# EAGLE design Micro_SD_Block (EAGLE 6.5.0)

## Sheet 1 of 2
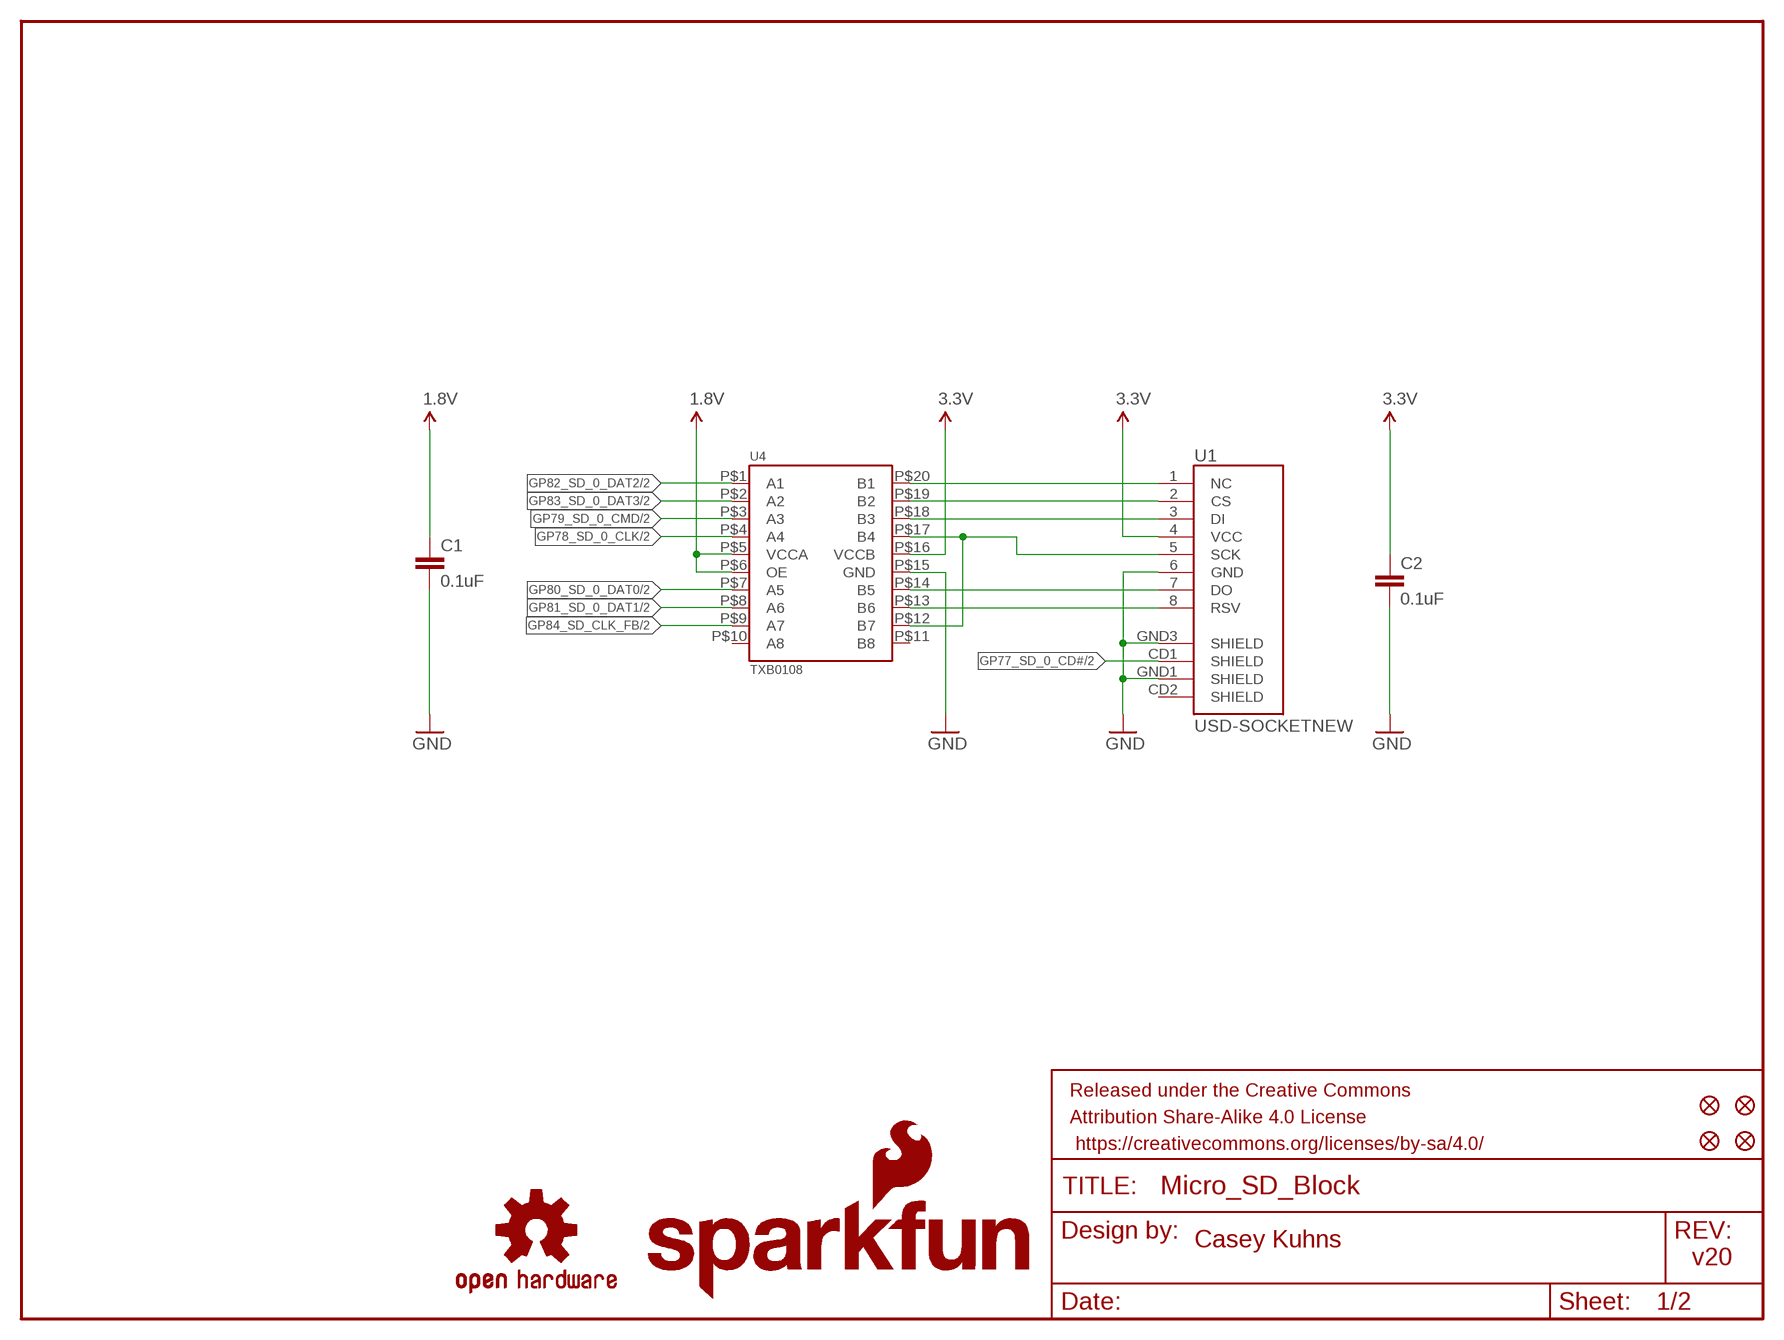
[diagram p0: schematic, sheet 1]

### Parts
C1  0.1uF  0.1UF-25V(+80/-20%)(0603)  [0603-CAP]
C2  0.1uF  0.1UF-25V(+80/-20%)(0603)  [0603-CAP]
FID1  FIDUCIAL1X2  [FIDUCIAL-1X2]
FID2  FIDUCIAL1X2  [FIDUCIAL-1X2]
FID3  FIDUCIAL1X2  [FIDUCIAL-1X2]
FID4  FIDUCIAL1X2  [FIDUCIAL-1X2]
FRAME1  FRAME-LETTER  [CREATIVE_COMMONS]
LOGO1  OSHW-LOGOS  [OSHW-LOGO-S]
LOGO4  SFE_LOGO_NAME_FLAME.1_INCH  [SFE_LOGO_NAME_FLAME_.1]
U1  USD-SOCKETNEW  [MICRO-SD-SOCKET-PP]
U4  TXB0108  [UFDFN-20]

### Nets
1.8V: C1.1 U4.P$5(VCCA) U4.P$6(OE) ; also sheet 2
3.3V: C2.1 U1.4(VCC) U4.P$16(VCCB) ; also sheet 2
GND: C1.2 C2.2 U1.6(GND) U1.GND1(SHIELD) U1.GND3(SHIELD) U4.P$15(GND) ; also sheet 2
GP77_SD_0_CD#: U1.CD1(SHIELD) ; also sheet 2
GP78_SD_0_CLK: U4.P$4(A4) ; also sheet 2
GP79_SD_0_CMD: U4.P$3(A3) ; also sheet 2
GP80_SD_0_DAT0: U4.P$7(A5) ; also sheet 2
GP81_SD_0_DAT1: U4.P$8(A6) ; also sheet 2
GP82_SD_0_DAT2: U4.P$1(A1) ; also sheet 2
GP83_SD_0_DAT3: U4.P$2(A2) ; also sheet 2
GP84_SD_CLK_FB: U4.P$9(A7) ; also sheet 2
N$1: U1.1(NC) U4.P$20(B1)
N$2: U1.2(CS) U4.P$19(B2)
N$3: U1.3(DI) U4.P$18(B3)
N$5: U1.7(DO) U4.P$14(B5)
N$6: U1.8(RSV) U4.P$13(B6)
SCK: U1.5(SCK) U4.P$12(B7) U4.P$17(B4)
Unconnected: U1.CD2(SHIELD) U4.P$10(A8) U4.P$11(B8)

### Notes on the sheet
- Casey Kuhns
- v20

## Sheet 2 of 2
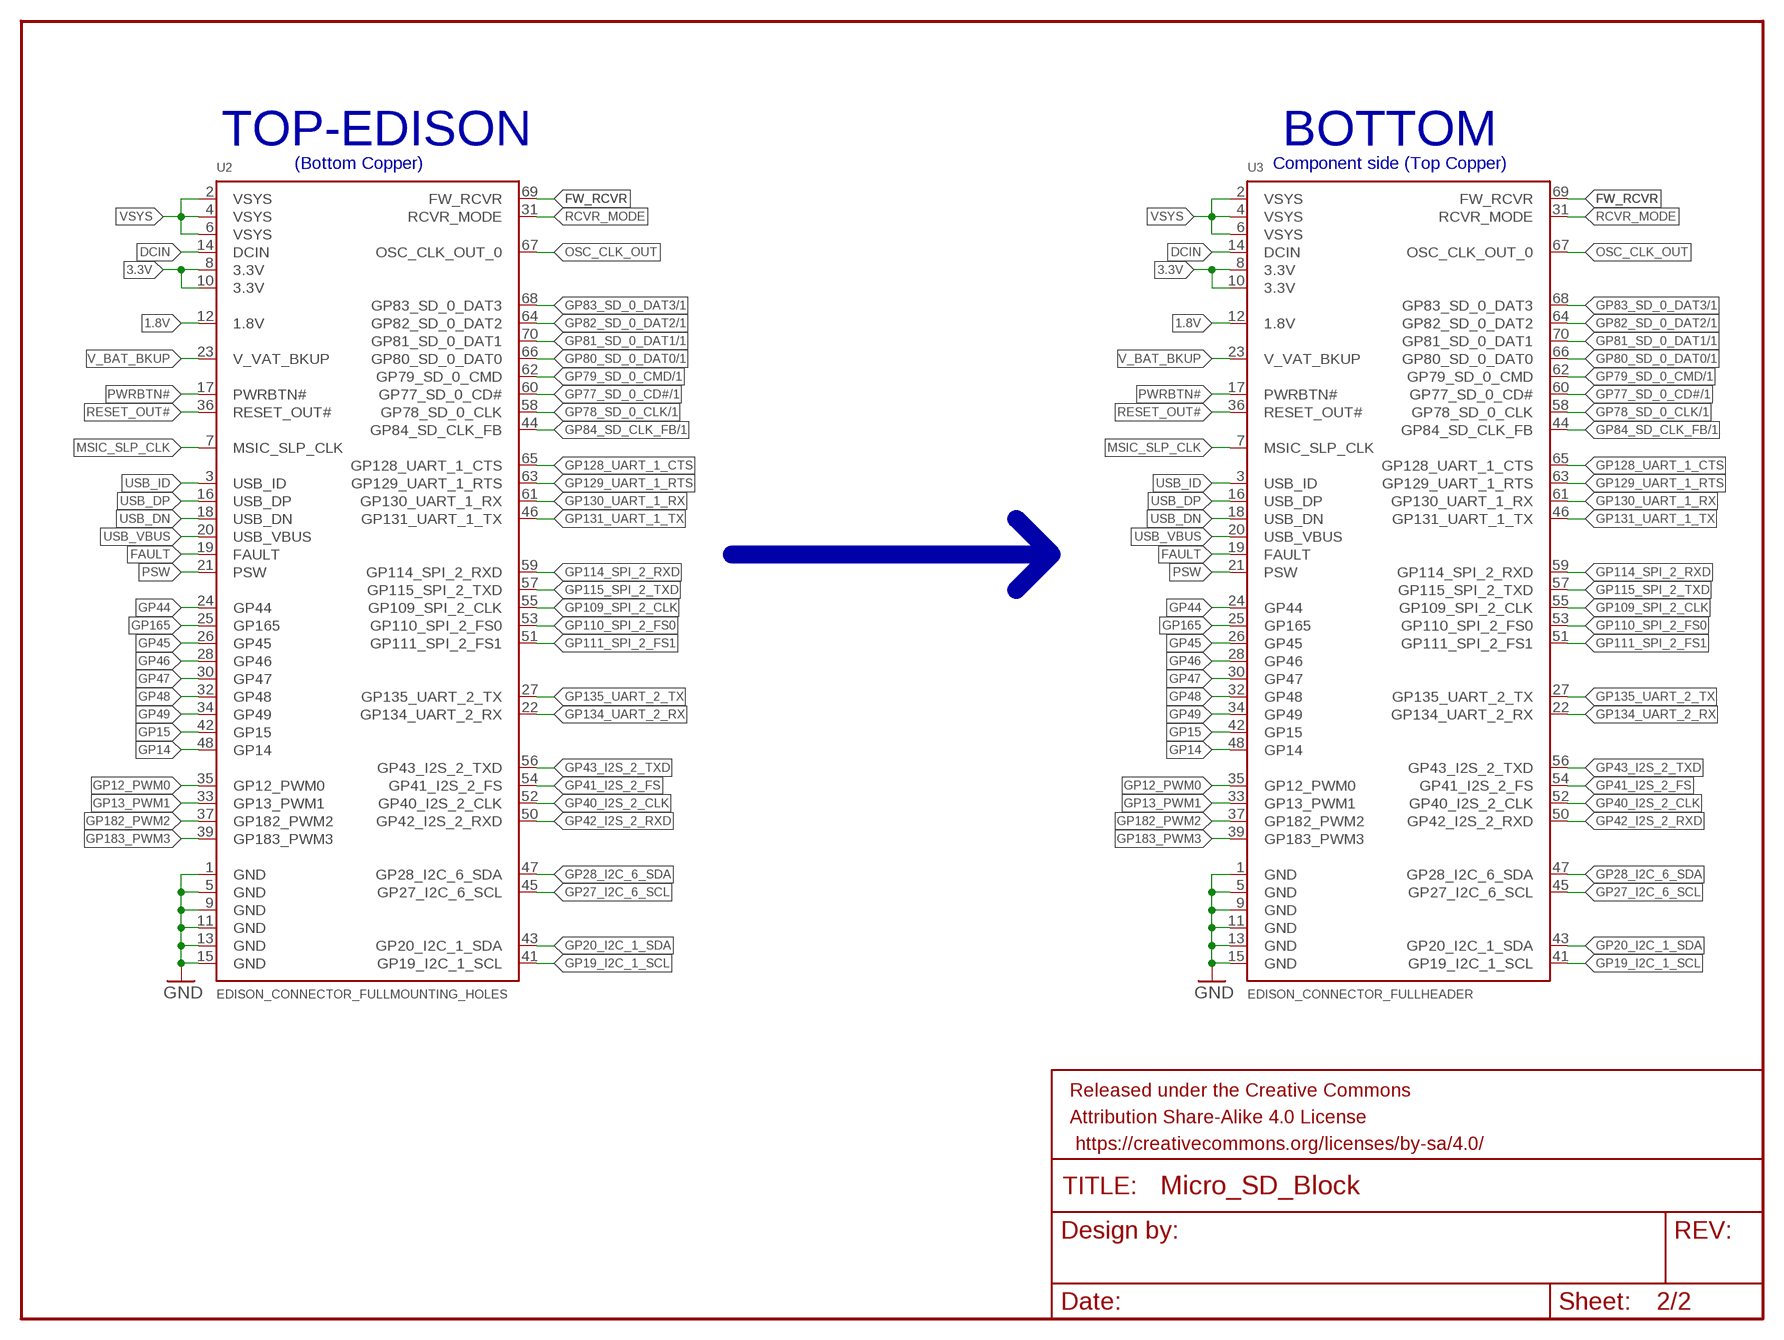
[diagram p1: schematic, sheet 2]

### Parts
FRAME2  FRAME-LETTER  [CREATIVE_COMMONS]
U2  EDISON_CONNECTOR_FULLMOUNTING_HOLES  [EDISON_DAUGHTER]
U3  EDISON_CONNECTOR_FULLHEADER  [DF40C-70DP-0.4(51)]

### Nets
1.8V: U2.12(1.8V) U3.12(1.8V) ; also sheet 1
3.3V: U2.8(3.3V) U2.10(3.3V) U3.8(3.3V) U3.10(3.3V) ; also sheet 1
DCIN: U2.14(DCIN) U3.14(DCIN)
FAULT: U2.19(FAULT) U3.19(FAULT)
FW_RCVR: U2.69(FW_RCVR) U3.69(FW_RCVR)
GND: U2.1(GND) U2.5(GND) U2.9(GND) U2.11(GND) U2.13(GND) U2.15(GND) U3.1(GND) U3.5(GND) U3.9(GND) U3.11(GND) U3.13(GND) U3.15(GND) ; also sheet 1
GP12_PWM0: U2.35(GP12_PWM0) U3.35(GP12_PWM0)
GP13_PWM1: U2.33(GP13_PWM1) U3.33(GP13_PWM1)
GP14: U2.48(GP14) U3.48(GP14)
GP15: U2.42(GP15) U3.42(GP15)
GP19_I2C_1_SCL: U2.41(GP19_I2C_1_SCL) U3.41(GP19_I2C_1_SCL)
GP20_I2C_1_SDA: U2.43(GP20_I2C_1_SDA) U3.43(GP20_I2C_1_SDA)
GP27_I2C_6_SCL: U2.45(GP27_I2C_6_SCL) U3.45(GP27_I2C_6_SCL)
GP28_I2C_6_SDA: U2.47(GP28_I2C_6_SDA) U3.47(GP28_I2C_6_SDA)
GP40_I2S_2_CLK: U2.52(GP40_I2S_2_CLK) U3.52(GP40_I2S_2_CLK)
GP41_I2S_2_FS: U2.54(GP41_I2S_2_FS) U3.54(GP41_I2S_2_FS)
GP42_I2S_2_RXD: U2.50(GP42_I2S_2_RXD) U3.50(GP42_I2S_2_RXD)
GP43_I2S_2_TXD: U2.56(GP43_I2S_2_TXD) U3.56(GP43_I2S_2_TXD)
GP44: U2.24(GP44) U3.24(GP44)
GP45: U2.26(GP45) U3.26(GP45)
GP46: U2.28(GP46) U3.28(GP46)
GP47: U2.30(GP47) U3.30(GP47)
GP48: U2.32(GP48) U3.32(GP48)
GP49: U2.34(GP49) U3.34(GP49)
GP77_SD_0_CD#: U2.60(GP77_SD_0_CD#) U3.60(GP77_SD_0_CD#) ; also sheet 1
GP78_SD_0_CLK: U2.58(GP78_SD_0_CLK) U3.58(GP78_SD_0_CLK) ; also sheet 1
GP79_SD_0_CMD: U2.62(GP79_SD_0_CMD) U3.62(GP79_SD_0_CMD) ; also sheet 1
GP80_SD_0_DAT0: U2.66(GP80_SD_0_DAT0) U3.66(GP80_SD_0_DAT0) ; also sheet 1
GP81_SD_0_DAT1: U2.70(GP81_SD_0_DAT1) U3.70(GP81_SD_0_DAT1) ; also sheet 1
GP82_SD_0_DAT2: U2.64(GP82_SD_0_DAT2) U3.64(GP82_SD_0_DAT2) ; also sheet 1
GP83_SD_0_DAT3: U2.68(GP83_SD_0_DAT3) U3.68(GP83_SD_0_DAT3) ; also sheet 1
GP84_SD_CLK_FB: U2.44(GP84_SD_CLK_FB) U3.44(GP84_SD_CLK_FB) ; also sheet 1
GP109_SPI_2_CLK: U2.55(GP109_SPI_2_CLK) U3.55(GP109_SPI_2_CLK)
GP110_SPI_2_FS0: U2.53(GP110_SPI_2_FS0) U3.53(GP110_SPI_2_FS0)
GP111_SPI_2_FS1: U2.51(GP111_SPI_2_FS1) U3.51(GP111_SPI_2_FS1)
GP114_SPI_2_RXD: U2.59(GP114_SPI_2_RXD) U3.59(GP114_SPI_2_RXD)
GP115_SPI_2_TXD: U2.57(GP115_SPI_2_TXD) U3.57(GP115_SPI_2_TXD)
GP128_UART_1_CTS: U2.65(GP128_UART_1_CTS) U3.65(GP128_UART_1_CTS)
GP129_UART_1_RTS: U2.63(GP129_UART_1_RTS) U3.63(GP129_UART_1_RTS)
GP130_UART_1_RX: U2.61(GP130_UART_1_RX) U3.61(GP130_UART_1_RX)
GP131_UART_1_TX: U2.46(GP131_UART_1_TX) U3.46(GP131_UART_1_TX)
GP134_UART_2_RX: U2.22(GP134_UART_2_RX) U3.22(GP134_UART_2_RX)
GP135_UART_2_TX: U2.27(GP135_UART_2_TX) U3.27(GP135_UART_2_TX)
GP165: U2.25(GP165) U3.25(GP165)
GP182_PWM2: U2.37(GP182_PWM2) U3.37(GP182_PWM2)
GP183_PWM3: U2.39(GP183_PWM3) U3.39(GP183_PWM3)
MSIC_SLP_CLK: U2.7(MSIC_SLP_CLK) U3.7(MSIC_SLP_CLK)
OSC_CLK_OUT: U2.67(OSC_CLK_OUT_0) U3.67(OSC_CLK_OUT_0)
PSW: U2.21(PSW) U3.21(PSW)
PWRBTN#: U2.17(PWRBTN#) U3.17(PWRBTN#)
RCVR_MODE: U2.31(RCVR_MODE) U3.31(RCVR_MODE)
RESET_OUT#: U2.36(RESET_OUT#) U3.36(RESET_OUT#)
USB_DN: U2.18(USB_DN) U3.18(USB_DN)
USB_DP: U2.16(USB_DP) U3.16(USB_DP)
USB_ID: U2.3(USB_ID) U3.3(USB_ID)
USB_VBUS: U2.20(USB_VBUS) U3.20(USB_VBUS)
V_BAT_BKUP: U2.23(V_VAT_BKUP) U3.23(V_VAT_BKUP)
VSYS: U2.2(VSYS) U2.4(VSYS) U2.6(VSYS) U3.2(VSYS) U3.4(VSYS) U3.6(VSYS)

### Buses
B$1

### Notes on the sheet
- TOP-EDISON | BOTTOM
- (Bottom Copper) | Component side (Top Copper)

## Library data of the parts
C1 C2 = SparkFun-Capacitors:0.1UF-25V(+80/-20%)(0603): CAP-00810 Ceramic Standard decoupling cap; PROD_ID: CAP-00810
FID1-FID4 = SparkFun-Aesthetics:FIDUCIAL: Fiducial Alignment Points Various fiducial points for machine vision alignment.
FRAME1 FRAME2 = SparkFun-Aesthetics:FRAME-LETTER: Schematic Frame Standard 8.5x11 US Letter frame
LOGO1 = SparkFun-Aesthetics:OSHW-LOGO: Open Source Hardware Logo This logo indicates the piece of hardware it is found on incorporates a OSHW license and/or adheres to the definition of open source hardware found here: http://freedomdefined.org/OSHW
LOGO4 = SparkFun-Aesthetics:SFE_LOGO_NAME_FLAME: SFE Logo, name and flame This is the SparkFun full logo. The logo on the schematic will always be the same size; the package variant is the height of the flame part of the logo. Default layer for the logo on the board is tSilk.
U1 = SparkFun-Connectors:USD-SOCKET: microSD Socket Push-push type uSD socket. Schematic element and footprint production proven. Spark Fun Electronics SKU : PRT-00127. tDoc lines correctly indicate media card edge positions when inserting (unlocked, locked, depressed).
U2 U3 = Edison:EDISON_CONNECTOR_FULL
U4 = Testing:TXB0108

## Board
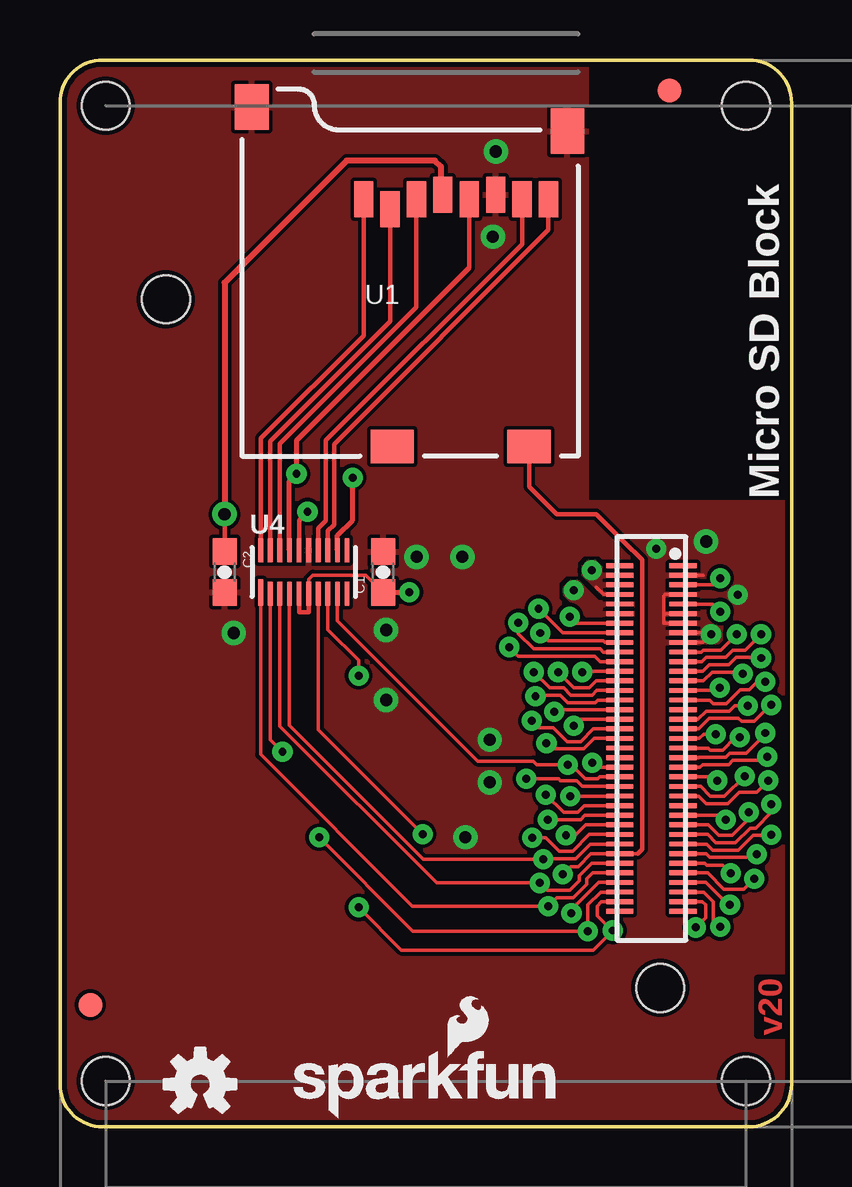
[diagram p2: board, top side]
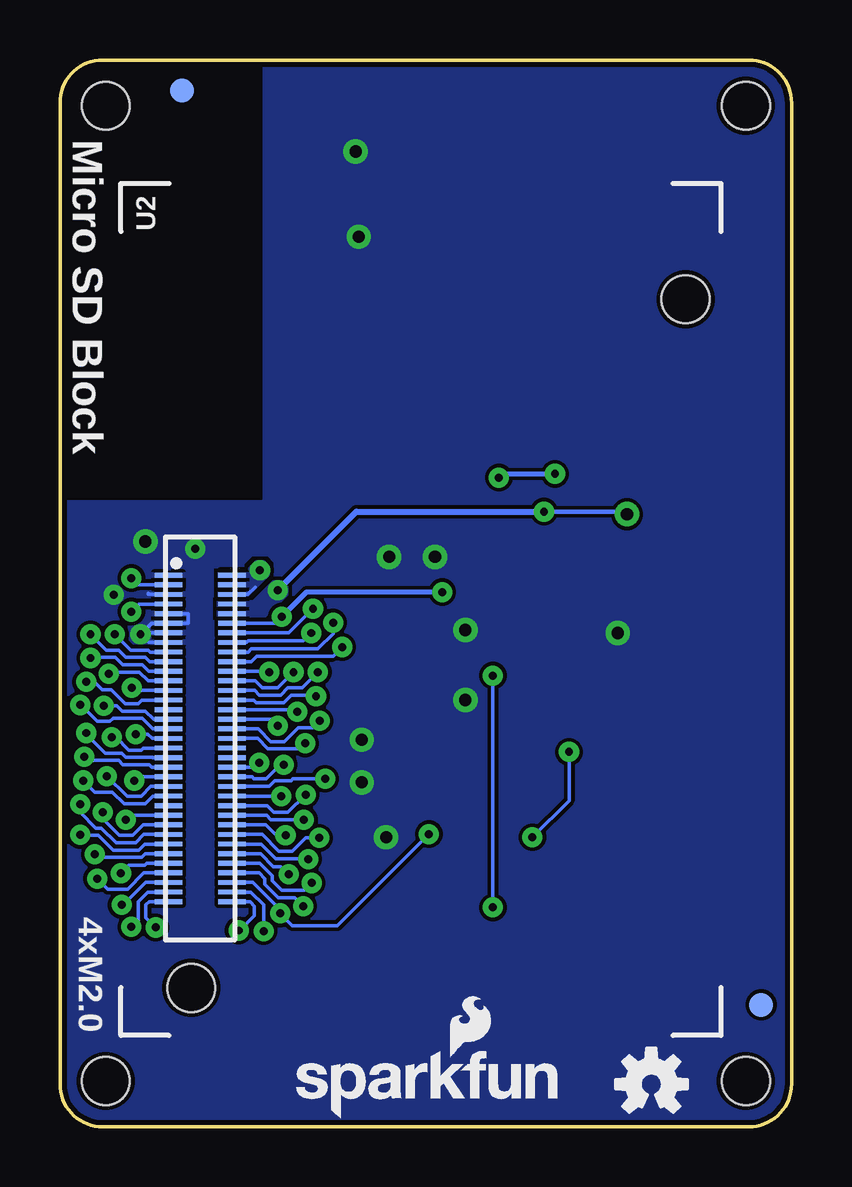
[diagram p3: board, bottom side, seen from below]

Size 30.48 x 44.45 mm. Coordinates in mm from the lower left corner, seen from the top.
Outline: 30.48,42.67 30.48,1.78 arc-90 28.7,0 1.78,0 arc-90 0,1.78 0,42.67 arc-90 1.78,44.45 28.7,44.45 arc-90 30.48,42.67
Copper layers (1*16): Top 0.035mm / dielectric 1.5mm / Bottom 0.035mm
Design rules "SparkFun-2-layer *": minimum track width 6mil, minimum drill 13mil, track to track 6mil, track to pad 6mil, pad to pad 6mil, via to via 6mil, smd to smd 6mil, copper to edge 8mil, drill to drill 8mil, minimum pad ring 12mil, minimum via ring 10mil, stop-mask expansion 4mil, vias tented up to drill 20mil, thermal gap 6mil
Holes 2 mm at 28.57,1.91 1.91,1.91 1.91,42.55 28.57,42.55
tRestrict: area 22.1,26.2 to 30.5,44.5
bRestrict: area 22.1,26.2 to 30.5,44.5; 1 lines

### Footprints (pad centres in the part's own frame; a part is rotated, then mirrored left to right if it is on the bottom)
0603-CAP = smd 1.1 x 1: 1 -0.85,0; 2 0.85,0
FIDUCIAL-1X2 = smd 1 x 1: 1 0,0
MICRO-SD-SOCKET-PP = smd 0.8 x 1.5: 1 -8.94,10.7; 2 -7.84,10.3; 3 -6.74,10.7; 4 -5.64,10.9; 5 -4.54,10.7; 6 -3.44,10.9; 7 -2.34,10.7; 8 -1.24,10.7 | smd 1.8 x 1.4: CD1 -2.05,0.4; CD2 -7.75,0.4 | smd 1.4 x 1.9: GND1 -13.6,14.55; GND3 -0.45,13.55
EDISON_DAUGHTER = smd 1.14 x 0.2: 1 1.98,19.17; 2 4.62,19.17; 3 1.98,18.77; 4 4.62,18.77; 5 1.98,18.37; 6 4.62,18.37; 7 1.98,17.97; 8 4.62,17.97; 9 1.98,17.57; 10 4.62,17.57; 11 1.98,17.17; 12 4.62,17.17; 13 1.98,16.77; 14 4.62,16.77; 15 1.98,16.37; 16 4.62,16.37; 17 1.98,15.97; 18 4.62,15.97; 19 1.98,15.57; 20 4.62,15.57; 21 1.98,15.17; 22 4.62,15.17; 23 1.98,14.77; 24 4.62,14.77; 25 1.98,14.37; 26 4.62,14.37; 27 1.98,13.97; 28 4.62,13.97; 29 1.98,13.57; 30 4.62,13.57; 31 1.98,13.17; 32 4.62,13.17; 33 1.98,12.77; 34 4.62,12.77; 35 1.98,12.37; 36 4.62,12.37; 37 1.98,11.97; 38 4.62,11.97; 39 1.98,11.57; 40 4.62,11.57; 41 1.98,11.17; 42 4.62,11.17; 43 1.98,10.77; 44 4.62,10.77; 45 1.98,10.37; 46 4.62,10.37; 47 1.98,9.97; 48 4.62,9.97; 49 1.98,9.57; 50 4.62,9.57; 51 1.98,9.17; 52 4.62,9.17; 53 1.98,8.77; 54 4.62,8.77; 55 1.98,8.37; 56 4.62,8.37; 57 1.98,7.97; 58 4.62,7.97; 59 1.98,7.57; 60 4.62,7.57; 61 1.98,7.17; 62 4.62,7.17; 63 1.98,6.77; 64 4.62,6.77; 65 1.98,6.37; 66 4.62,6.37; 67 1.98,5.97; 68 4.62,5.97; 69 1.98,5.57; 70 4.62,5.57 | hole 2: 23.53,30.67; 2.93,1.98
DF40C-70DP-0.4(51) = smd 0.2 x 1.14 bottom: 1 6.8,1.32; 2 6.8,-1.32; 3 6.4,1.32; 4 6.4,-1.32; 5 6,1.32; 6 6,-1.32; 7 5.6,1.32; 8 5.6,-1.32; 9 5.2,1.32; 10 5.2,-1.32; 11 4.8,1.32; 12 4.8,-1.32; 13 4.4,1.32; 14 4.4,-1.32; 15 4,1.32; 16 4,-1.32; 17 3.6,1.32; 18 3.6,-1.32; 19 3.2,1.32; 20 3.2,-1.32; 21 2.8,1.32; 22 2.8,-1.32; 23 2.4,1.32; 24 2.4,-1.32; 25 2,1.32; 26 2,-1.32; 27 1.6,1.32; 28 1.6,-1.32; 29 1.2,1.32; 30 1.2,-1.32; 31 0.8,1.32; 32 0.8,-1.32; 33 0.4,1.32; 34 0.4,-1.32; 35 0,1.32; 36 0,-1.32; 37 -0.4,1.32; 38 -0.4,-1.32; 39 -0.8,1.32; 40 -0.8,-1.32; 41 -1.2,1.32; 42 -1.2,-1.32; 43 -1.6,1.32; 44 -1.6,-1.32; 45 -2,1.32; 46 -2,-1.32; 47 -2.4,1.32; 48 -2.4,-1.32; 49 -2.8,1.32; 50 -2.8,-1.32; 51 -3.2,1.32; 52 -3.2,-1.32; 53 -3.6,1.32; 54 -3.6,-1.32; 55 -4,1.32; 56 -4,-1.32; 57 -4.4,1.32; 58 -4.4,-1.32; 59 -4.8,1.32; 60 -4.8,-1.32; 61 -5.2,1.32; 62 -5.2,-1.32; 63 -5.6,1.32; 64 -5.6,-1.32; 65 -6,1.32; 66 -6,-1.32; 67 -6.4,1.32; 68 -6.4,-1.32; 69 -6.8,1.32; 70 -6.8,-1.32; NC1 7.2,1.32; NC2 7.2,-1.32; NC3 -7.2,-1.32; NC4 -7.2,1.32
UFDFN-20 = smd 0.2 x 1.1: P$1 -1.8,-0.85 | smd 0.2 x 1: P$2 -1.4,-0.9; P$3 -1,-0.9; P$4 -0.6,-0.9; P$5 -0.2,-0.9; P$6 0.2,-0.9; P$7 0.6,-0.9; P$8 1,-0.9; P$9 1.4,-0.9; P$10 1.8,-0.9; P$11 1.8,0.9; P$12 1.4,0.9; P$13 1,0.9; P$14 0.6,0.9; P$15 0.2,0.9; P$16 -0.2,0.9; P$17 -0.6,0.9; P$18 -1,0.9; P$19 -1.4,0.9; P$20 -1.8,0.9

### Placement (x,y rotation side)
C1  13.46,23.11 90 top
C2  6.86,23.11 270 top
FID1  1.27,5.08 0 top
FID2  25.4,43.18 0 top
FID3  1.27,5.08 0 bottom
FID4  25.4,43.18 0 bottom
FRAME1  -1.27,-13.97 0 top  (outside the outline)
FRAME2  -1.27,-13.97 0 top  (outside the outline)
LOGO1  5.84,1.78 0 top
LOGO2  OSHW-LOGOS  [OSHW-LOGO-S]  5.84,1.78 0 bottom
LOGO3  SFE_LOGO_NAME_FLAME.1_INCH  [SFE_LOGO_NAME_FLAME_.1]  21.08,0.25 0 bottom
LOGO4  9.3,0.25 0 top
U1  21.59,27.94 0 top
U2  27.94,3.81 0 bottom
U3  24.64,16.18 90 bottom
U4  10.16,23.11 0 top

### Tracks (layer width: path | path; a pad name or v marks a point on that pad's centre or on a via)
1.8V  (via drill 0.33)
  Top 0.152: U4.P$6 10.36,22.81 10.54,22.99 12.74,22.99 C1.1 arc90 13.48,22.28 | v21.23,21.26 21.51,20.98 U3.12
  Top 0.178: U4.P$6 10.36,21.44 9.96,21.44 U4.P$5
  Top 0.203: 13.48,22.28 v14.55,22.28
  Bottom 0.152: U3.12 21.51,20.98 v21.23,21.26
  Bottom 0.203: v14.55,22.28 20.22,22.28 v21.23,21.26
3.3V  (via drill 0.33, 0.51)
  Top 0.178: U4.P$16 9.96,25.28 v10.31,25.63 | C2.1 v6.86,25.53
  Top 0.254: U1.4 15.88,38.77 15.88,40.01 15.62,40.26 11.94,40.26 6.86,35.18 v6.86,25.53
  Bottom 0.178: v6.86,25.53 6.96,25.63 v10.31,25.63
  Bottom 0.254: v10.31,25.63 18.14,25.63 v21.41,22.35
  pour Top (isolate 0.051): 23.88,21.29 23.88,21.87 22.43,21.87 21.59,22.71 21.26,22.71 21.03,22.48 21.03,22.17 21.92,21.29
  pour Bottom (isolate 0.051): 23.88,21.29 23.88,21.87 22.43,21.87 21.59,22.71 21.26,22.71 21.03,22.48 21.03,22.17 21.92,21.29
DCIN  (via drill 0.33)
  Top 0.152: U3.14 20.95,20.58 v19.94,21.59
  Bottom 0.152: v19.94,21.59 20.95,20.58 U3.14
FAULT  (via drill 0.33)
  Top 0.152: U3.19 26.75,19.38 26.92,19.56 27.74,19.56 28.04,19.86 28.55,19.86 v29.21,20.52
  Bottom 0.152: v29.21,20.52 28.55,19.86 28.04,19.86 27.74,19.56 26.92,19.56 26.75,19.38 U3.19
FW_RCVR  (via drill 0.33)
  Top 0.152: v26.49,8.31 26.9,8.71 26.9,9.25 26.76,9.38 U3.69
  Bottom 0.152: U3.69 26.76,9.38 26.9,9.25 26.9,8.71 v26.49,8.31
GND  (via drill 0.33, 0.51)
  Top 0.152: U3.1 26.8,22.98 26.8,22.99 | U3.13 27.07,20.58 v27.13,20.52 26.78,20.18 U3.15 | U3.5 25.23,22.18 25.15,22.1 25.15,21.38 | U3.11 25.15,20.98 25.15,21.34 25.15,21.38 | U3.9 25.15,21.38
  Bottom 0.152: U3.5 26.8,22.18 26.8,22.23 | U3.11 26.67,20.98 v27.13,20.52 | U3.11 26.64,20.98 27.05,20.57 | U3.13 27.07,20.58 v27.13,20.52 | U3.15 26.78,20.18 v27.13,20.52 | U3.9 25.15,21.38 25.15,20.98 U3.11
  other vias: 28.24,22.17 14.86,23.75 16.76,23.75 7.24,20.57 26.92,24.38 24.84,24.08 13.59,17.78 17.91,14.35 16.89,12.06 17.91,16.13 13.59,20.7 18.03,37.08 18.16,40.64
  pour Bottom (isolate 0.051, rank 6): 30.48,42.67 30.48,1.78 arc-90 28.7,0 1.78,0 arc-90 0,1.78 0,42.67 arc-90 1.78,44.45 28.7,44.45 arc-90
  pour Top (isolate 0.051, rank 6): 30.48,1.73 arc-90 28.75,0 1.78,0 arc-90 0,1.78 0,42.67 arc-90 1.78,44.45 28.7,44.45 arc-90 30.48,42.67
GP12_PWM0  (via drill 0.33)
  Top 0.152: U3.35 26.64,16.18 26.82,16.36 v27.33,16.36
  Bottom 0.152: v27.33,16.36 26.82,16.36 26.64,16.18 U3.35 | U3.35
GP13_PWM1  (via drill 0.33)
  Top 0.152: v29.64,17.58 29.62,17.58 28.93,16.89 28.4,16.89 28.27,17.02 27.05,17.02 26.61,16.58 U3.33
  Bottom 0.152: U3.33 26.61,16.58 27.05,17.02 28.27,17.02 28.4,16.89 28.93,16.89 29.62,17.58 v29.64,17.58
GP14  (via drill 0.33)
  Top 0.152: v21.26,13.77 21.27,13.78 U3.48
  Bottom 0.152: U3.48 21.27,13.78 v21.26,13.77
GP15  (via drill 0.33)
  Top 0.152: U3.42 22.36,14.98 v22.17,15.16
  Bottom 0.152: v22.17,15.16 22.36,14.98 U3.42
GP19_I2C_1_SCL  (via drill 0.33)
  Top 0.152: U3.41 26.66,14.98 26.77,15.09 27.86,15.09 28.04,15.27 29.31,15.27 v29.46,15.42
  Bottom 0.152: v29.46,15.42 29.31,15.27 28.04,15.27 27.86,15.09 26.77,15.09 26.66,14.98 U3.41
GP20_I2C_1_SDA  (via drill 0.33)
  Top 0.152: U3.43 27.23,14.58 v27.38,14.43
  Bottom 0.152: v27.38,14.43 27.23,14.58 U3.43 | U3.43
GP27_I2C_6_SCL  (via drill 0.33)
  Top 0.152: v28.52,14.61 27.69,13.77 27.1,13.77 26.69,14.18 U3.45
  Bottom 0.152: U3.45 26.69,14.18 27.1,13.77 27.69,13.77 v28.52,14.61
GP28_I2C_6_SDA  (via drill 0.33)
  Top 0.152: U3.47 26.61,13.78 26.92,13.46 27.81,13.46 28.3,13.95 29.03,13.95 v29.52,14.43
  Bottom 0.152: v29.52,14.43 29.03,13.95 28.3,13.95 27.81,13.46 26.92,13.46 26.61,13.78 U3.47
GP40_I2S_2_CLK  (via drill 0.33)
  Top 0.152: U3.52 21.87,12.98 21.69,12.8 v20.32,12.8
  Bottom 0.152: v20.32,12.8 21.69,12.8 21.87,12.98 U3.52
GP41_I2S_2_FS  (via drill 0.33)
  Top 0.152: v21.08,12.14 21.46,12.14 21.9,12.58 U3.54
  Bottom 0.152: U3.54 21.9,12.58 21.46,12.14 v21.08,12.14
GP42_I2S_2_RXD  (via drill 0.33)
  Top 0.152: U3.50 21.84,13.38 21.57,13.11 20.98,13.11 v20.24,13.84
  Bottom 0.152: v20.24,13.84 20.98,13.11 21.57,13.11 21.84,13.38 U3.50
GP43_I2S_2_TXD  (via drill 0.33)
  Top 0.152: U3.56 22.06,12.18 21.36,11.48 20.8,11.48 20.24,12.04 v19.68,12.04
  Bottom 0.152: v19.68,12.04 20.24,12.04 20.8,11.48 21.36,11.48 22.06,12.18 U3.56
GP44  (via drill 0.33)
  Top 0.152: U3.24 22.34,18.58 22.05,18.29 21.41,18.29 v20.75,18.95
  Bottom 0.152: v20.75,18.95 21.41,18.29 22.05,18.29 22.34,18.58 U3.24
GP45  (via drill 0.33)
  Top 0.152: v19.74,18.95 20.4,18.29 20.98,18.29 21.29,17.98 22.17,17.98 22.37,18.18 U3.26
  Bottom 0.152: U3.26 22.37,18.18 22.17,17.98 21.29,17.98 20.98,18.29 20.4,18.29 v19.74,18.95
GP46  (via drill 0.33)
  Top 0.152: U3.28 22.4,17.78 22.3,17.68 21.16,17.68 20.85,17.98 19.86,17.98 v19.81,17.93
  Bottom 0.152: v19.81,17.93 19.86,17.98 20.85,17.98 21.16,17.68 22.3,17.68 22.4,17.78 U3.28
GP47  (via drill 0.33)
  Top 0.152: U3.30 22.43,17.38 22.43,17.37 20.68,17.37 v20.6,17.3
  Bottom 0.152: v20.6,17.3 20.68,17.37 22.43,17.37 22.43,17.38 U3.30
GP48  (via drill 0.33)
  Top 0.152: v21.41,16.71 21.68,16.98 U3.32
  Bottom 0.152: U3.32 21.68,16.98 v21.41,16.71
GP49  (via drill 0.33)
  Top 0.152: U3.34 22.22,16.58 21.69,16.05 21.13,16.05 20.55,16.64 19.94,16.64 v19.66,16.92
  Bottom 0.152: v19.66,16.92 19.94,16.64 20.55,16.64 21.13,16.05 21.69,16.05 22.22,16.58 U3.34
GP77_SD_0_CD#  (via drill 0.33)
  Top 0.152: v20.95,10.52 21.29,10.85 21.59,10.85 22.12,11.38 24.08,11.38 | U3.60 24.08,11.38 | 24.08,11.38 24.26,11.56
  Top 0.178: 19.54,27.83 U1.CD1 19.56,28.32 19.56,26.67 20.7,25.53 22.35,25.53 23.5,24.39 23.5,24.38 24.26,23.62 24.26,11.56 24.08,11.38
  Bottom 0.152: U3.60 22.12,11.38 21.59,10.85 21.29,10.85 v20.95,10.52
GP78_SD_0_CLK  (via drill 0.33)
  Top 0.152: U3.58 22.09,11.78 21.49,11.18 20.17,11.18 v20.14,11.15 15.14,11.15 9.56,16.73 U4.P$4
  Bottom 0.152: v20.14,11.15 20.17,11.18 21.49,11.18 22.09,11.78 U3.58
GP79_SD_0_CMD  (via drill 0.33)
  Top 0.152: U3.62 22.16,10.98 21.64,10.46 21.64,10.26 21.23,9.86 20.3,9.86 v19.99,10.16 15.7,10.16 9.16,16.7 U4.P$3
  Bottom 0.152: v19.99,10.16 20.3,9.86 21.23,9.86 21.64,10.26 21.64,10.46 22.16,10.98 U3.62
GP80_SD_0_DAT0  (via drill 0.33)
  Top 0.152: v21.31,8.89 21.31,9.04 22.45,10.18 U3.66 | v15.11,12.19 10.76,16.55 U4.P$7
  Bottom 0.152: U3.66 22.45,10.18 21.31,9.04 v21.31,8.89 20.8,8.38 18.92,8.38 v15.11,12.19
GP81_SD_0_DAT1  (via drill 0.33)
  Top 0.152: U3.70 22.56,9.38 22.38,9.2 22.38,8.79 22.99,8.18 v23.04,8.18 22.23,7.37 14.22,7.37 v12.45,9.14 | U4.P$8 11.16,20.72 12.45,19.43 v12.45,18.8
  Bottom 0.152: v23.04,8.18 22.99,8.18 22.38,8.79 22.38,9.2 22.56,9.38 U3.70 | v12.45,18.8 v12.45,9.14
GP82_SD_0_DAT2  (via drill 0.33)
  Top 0.152: U3.64 22.19,10.58 21.95,10.34 21.95,10.11 21.39,9.55 20.7,9.55 v20.34,9.2 14.68,9.2 8.36,15.52 U4.P$1
  Bottom 0.152: v20.34,9.2 20.7,9.55 21.39,9.55 21.95,10.11 21.95,10.34 22.19,10.58 U3.64
GP83_SD_0_DAT3  (via drill 0.33)
  Top 0.152: U3.68 22.53,9.78 22,9.25 v22,8.15 14.71,8.15 v10.79,12.06 | U4.P$2 8.76,16.13 v9.27,15.62
  Bottom 0.152: U3.68 22.53,9.78 22,9.25 v22,8.15 | v9.27,15.62 9.27,13.59 v10.79,12.06
GP84_SD_CLK_FB  (via drill 0.33)
  Top 0.152: U3.44 22.48,14.58 22.4,14.5 21.89,14.5 21.31,15.09 v21.16,15.09 19.86,15.09 19.71,15.24 17.4,15.24 11.56,21.08 U4.P$9
  Bottom 0.152: v21.16,15.09 21.31,15.09 21.89,14.5 22.4,14.5 22.48,14.58 U3.44 | U3.44
GP109_SPI_2_CLK  (via drill 0.33)
  Top 0.152: U3.55 26.99,12.18 27.33,11.84 28.14,11.84 28.75,12.45 28.98,12.45 29.64,13.11 v29.64,13.44
  Bottom 0.152: v29.64,13.44 29.64,13.11 28.98,12.45 28.75,12.45 28.14,11.84 27.33,11.84 26.99,12.18 U3.55
GP110_SPI_2_FS0  (via drill 0.33)
  Top 0.152: v28.7,13.11 28.7,12.83 28.02,12.14 27.46,12.14 27.02,12.58 U3.53
  Bottom 0.152: U3.53 27.02,12.58 27.46,12.14 28.02,12.14 28.7,12.83 v28.7,13.11
GP111_SPI_2_FS1  (via drill 0.33)
  Top 0.152: v27.74,12.8 27.56,12.98 U3.51
  Bottom 0.152: U3.51 27.56,12.98 v27.74,12.8
GP114_SPI_2_RXD  (via drill 0.33)
  Top 0.152: U3.59 26.92,11.38 27.08,11.23 28.91,11.23 v29.03,11.35
  Bottom 0.152: U3.59 26.92,11.38 27.08,11.23 28.91,11.23 v29.03,11.35
GP115_SPI_2_TXD  (via drill 0.33)
  Top 0.152: U3.57 26.95,11.78 27.2,11.53 28.27,11.53 28.88,12.14 29.62,12.14 v29.64,12.17
  Bottom 0.152: U3.57 26.95,11.78 27.2,11.53 28.27,11.53 28.88,12.14 29.62,12.14 v29.64,12.17
GP128_UART_1_CTS  (via drill 0.33)
  Top 0.152: U3.65 26.9,10.18 27.84,9.25 v27.91,9.25
  Bottom 0.152: v27.91,9.25 27.84,9.25 26.9,10.18 U3.65
GP129_UART_1_RTS  (via drill 0.33)
  Top 0.152: v28.93,10.34 28.5,9.91 27.66,9.91 26.99,10.58 U3.63
  Bottom 0.152: U3.63 26.99,10.58 27.66,9.91 28.5,9.91 v28.93,10.34
GP130_UART_1_RX  (via drill 0.33)
  Top 0.152: v27.94,10.57 27.61,10.9 26.95,10.9 26.87,10.98 U3.61
  Bottom 0.152: U3.61 26.87,10.98 26.95,10.9 27.61,10.9 v27.94,10.57
GP131_UART_1_TX  (via drill 0.33)
  Top 0.152: U3.46 22.52,14.18 22.5,14.2 21.77,14.2 21.54,14.43 20.85,14.43 20.78,14.5 v19.43,14.5
  Bottom 0.152: v19.43,14.5 20.78,14.5 20.85,14.43 21.54,14.43 21.77,14.2 22.5,14.2 22.52,14.18 U3.46
GP134_UART_2_RX  (via drill 0.33)
  Top 0.152: v21.77,18.95 21.8,18.98 U3.22
  Bottom 0.152: U3.22 21.8,18.98 v21.77,18.95
GP135_UART_2_TX  (via drill 0.33)
  Top 0.152: v29.39,18.54 29.06,18.54 28.73,18.21 28.35,18.21 27.76,17.63 27.23,17.63 27.08,17.78 U3.27
  Bottom 0.152: U3.27 27.08,17.78 27.23,17.63 27.76,17.63 28.35,18.21 28.73,18.21 29.06,18.54 v29.39,18.54
GP165  (via drill 0.33)
  Top 0.152: v27.48,18.29 27.38,18.18 U3.25
  Bottom 0.152: U3.25 27.38,18.18 v27.48,18.29
GP182_PWM2  (via drill 0.33)
  Top 0.152: U3.37 27.02,15.78 27.1,15.7 27.61,15.7 28.14,16.23 v28.32,16.23
  Bottom 0.152: v28.32,16.23 28.14,16.23 27.61,15.7 27.1,15.7 27.02,15.78 U3.37
GP183_PWM3  (via drill 0.33)
  Top 0.152: v29.39,16.41 29.39,16.36 28.6,15.57 27.91,15.57 27.74,15.39 26.62,15.39 26.61,15.38 U3.39
  Bottom 0.152: U3.39 26.61,15.38 26.62,15.39 27.74,15.39 27.91,15.57 28.6,15.57 29.39,16.36 v29.39,16.41
MSIC_SLP_CLK  (via drill 0.33)
  Top 0.152: v27.51,21.46 27.19,21.78 U3.7
  Bottom 0.152: U3.7 27.19,21.78 v27.51,21.46
N$1
  Top 0.178: U4.P$20 8.36,28.68 12.65,32.97 U1.1
N$2
  Top 0.178: U4.P$19 8.76,28.57 13.75,33.56 U1.2
N$3
  Top 0.178: U4.P$18 9.16,28.46 14.85,34.15 U1.3
N$5
  Top 0.178: U1.7 19.25,36.78 11.07,28.6 11.07,25.25 10.76,24.93 U4.P$14
N$6
  Top 0.178: U1.8 20.35,37.37 11.43,28.45 11.43,25.09 11.16,24.82 U4.P$13
OSC_CLK_OUT  (via drill 0.33)
  Top 0.152: v27.51,8.33 27.23,8.61 27.23,9.37 26.82,9.78 U3.67
  Bottom 0.152: U3.67 26.82,9.78 27.23,9.37 27.23,8.61 v27.51,8.33
PSW  (via drill 0.33)
  Top 0.152: v29.21,19.53 29.18,19.56 28.17,19.56 27.86,19.25 27.05,19.25 26.78,18.98 U3.21
  Bottom 0.152: U3.21 26.78,18.98 27.05,19.25 27.86,19.25 28.17,19.56 29.18,19.56 v29.21,19.53
PWRBTN#  (via drill 0.33)
  Top 0.152: v28.19,20.52 27.53,19.86 26.8,19.86 26.71,19.78 U3.17
  Bottom 0.152: U3.17 26.71,19.78 26.8,19.86 27.53,19.86 v28.19,20.52
RCVR_MODE  (via drill 0.33)
  Top 0.152: v28.65,17.55 28.12,17.55 27.89,17.32 26.92,17.32 26.58,16.98 U3.31
  Bottom 0.152: U3.31 26.58,16.98 26.92,17.32 27.89,17.32 28.12,17.55 v28.65,17.55
RESET_OUT#  (via drill 0.33)
  Top 0.152: U3.36 22.25,16.18 21.82,15.75 20.5,15.75 v20.27,15.98
  Bottom 0.152: v20.27,15.98 20.5,15.75 21.82,15.75 22.25,16.18 U3.36
SCK  (via drill 0.33)
  Top 0.178: 17.05,35.8 U1.5
  Top 0.203: U4.P$17 9.56,26.91 v9.86,27.2 9.86,28.6 17.05,35.8 | U4.P$12 11.56,24.64 12.19,25.27 v12.19,27.05
  Bottom 0.203: v12.19,27.05 12.04,27.2 v9.86,27.2
USB_DN  (via drill 0.33)
  Top 0.152: U3.18 22.64,19.78 22.5,19.91 19.74,19.91 19.1,20.55 v19.1,21.01
  Bottom 0.152: v19.1,21.01 19.1,20.55 19.74,19.91 22.5,19.91 22.64,19.78 U3.18
USB_DP  (via drill 0.33)
  Top 0.152: v20.02,20.57 20.34,20.24 22.63,20.24 22.7,20.18 U3.16
  Bottom 0.152: U3.16 22.7,20.18 22.63,20.24 20.34,20.24 v20.02,20.57
USB_ID  (via drill 0.33)
  Top 0.152: v27.51,22.86 27.23,22.58 U3.3
  Bottom 0.152: U3.3 27.23,22.58 v27.51,22.86
USB_VBUS  (via drill 0.33)
  Top 0.152: v18.72,19.99 19.1,19.61 22.28,19.61 22.5,19.38 U3.20
  Bottom 0.152: U3.20 22.5,19.38 22.28,19.61 19.1,19.61 v18.72,19.99
V_BAT_BKUP  (via drill 0.33)
  Top 0.152: v28.45,18.87 28.37,18.95 27.18,18.95 26.81,18.58 U3.23
  Bottom 0.152: U3.23 26.81,18.58 27.18,18.95 28.37,18.95 v28.45,18.87
VSYS  (via drill 0.33)
  Top 0.152: U3.6 22.65,22.18 22.35,22.48
  Top 0.2: U3.4
  Bottom 0.152: U3.6 22.65,22.18 22.35,22.48
  Bottom 0.2: U3.4
  other vias: 22.15,23.19
  pour Top (isolate 0.051, rank 2): 22.68,22.12 23.85,22.12 23.85,23.09 22.76,23.09 22.3,23.55 22,23.55 21.79,23.34 21.79,23.01
  pour Bottom (isolate 0.051, rank 2): 22.68,22.12 23.85,22.12 23.85,23.09 22.76,23.09 22.3,23.55 22,23.55 21.79,23.34 21.79,23.01

### Text on the board
Top: v20
tPlace: Micro SD Block
bPlace: Micro SD Block | 4xM2.0
tDocu: Note: Units are in Inches | Casey Kuhns